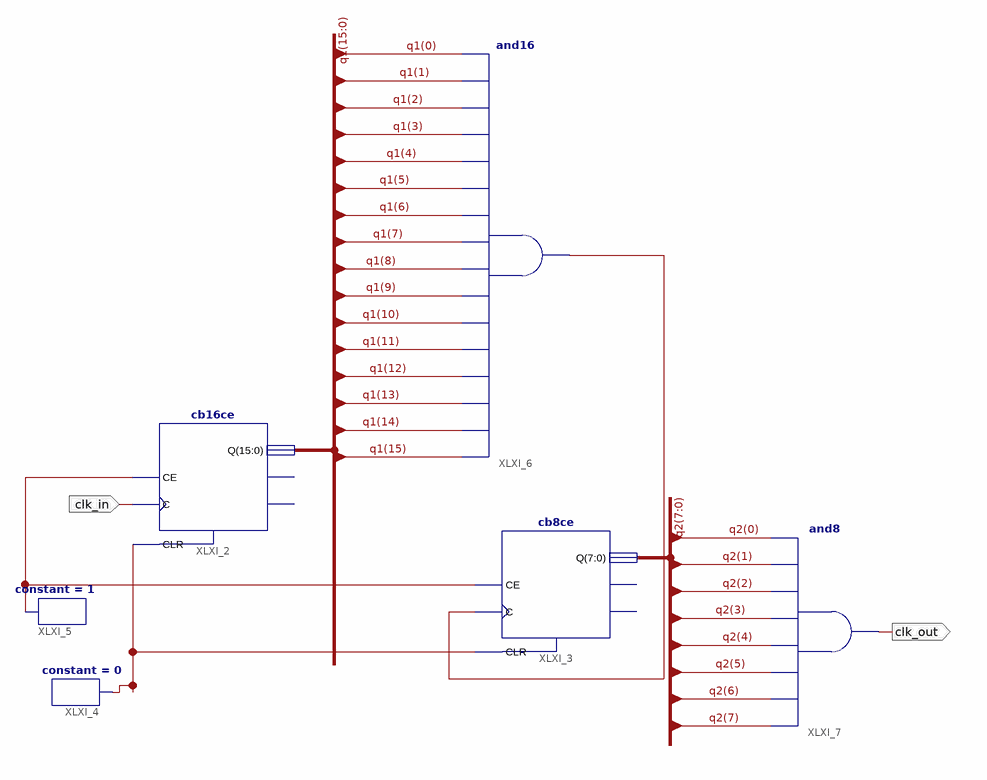
[diagram p0: schematic sheet 1]
// Xilinx ISE schematic sys_clk_adepder.sch (spartan3e) as structural Verilog: 6 symbols, 2 ports
module sys_clk_adepder (
  input  clk_in,
  output clk_out
);

  wire XLXN_6, XLXN_7, XLXN_25;
  wire [7:0] q2;
  wire [15:0] q1;

  cb16ce XLXI_2 (.C(clk_in), .CE(XLXN_6), .CLR(XLXN_7), .Q(q1));  // open: CEO, TC
  cb8ce XLXI_3 (.C(XLXN_25), .CE(XLXN_6), .CLR(XLXN_7), .Q(q2));  // open: CEO, TC
  constant #(.CValue("0")) XLXI_4 (.O(XLXN_7));
  constant #(.CValue("1")) XLXI_5 (.O(XLXN_6));
  and XLXI_6 (XLXN_25, q1[15], q1[14], q1[13], q1[12], q1[11], q1[10], q1[9], q1[8], q1[7], q1[6], q1[5], q1[4], q1[3], q1[2], q1[1], q1[0]);
  and XLXI_7 (clk_out, q2[7], q2[6], q2[5], q2[4], q2[3], q2[2], q2[1], q2[0]);
endmodule
